# EAGLE design adns3050 v7 (EAGLE 6.6.0)
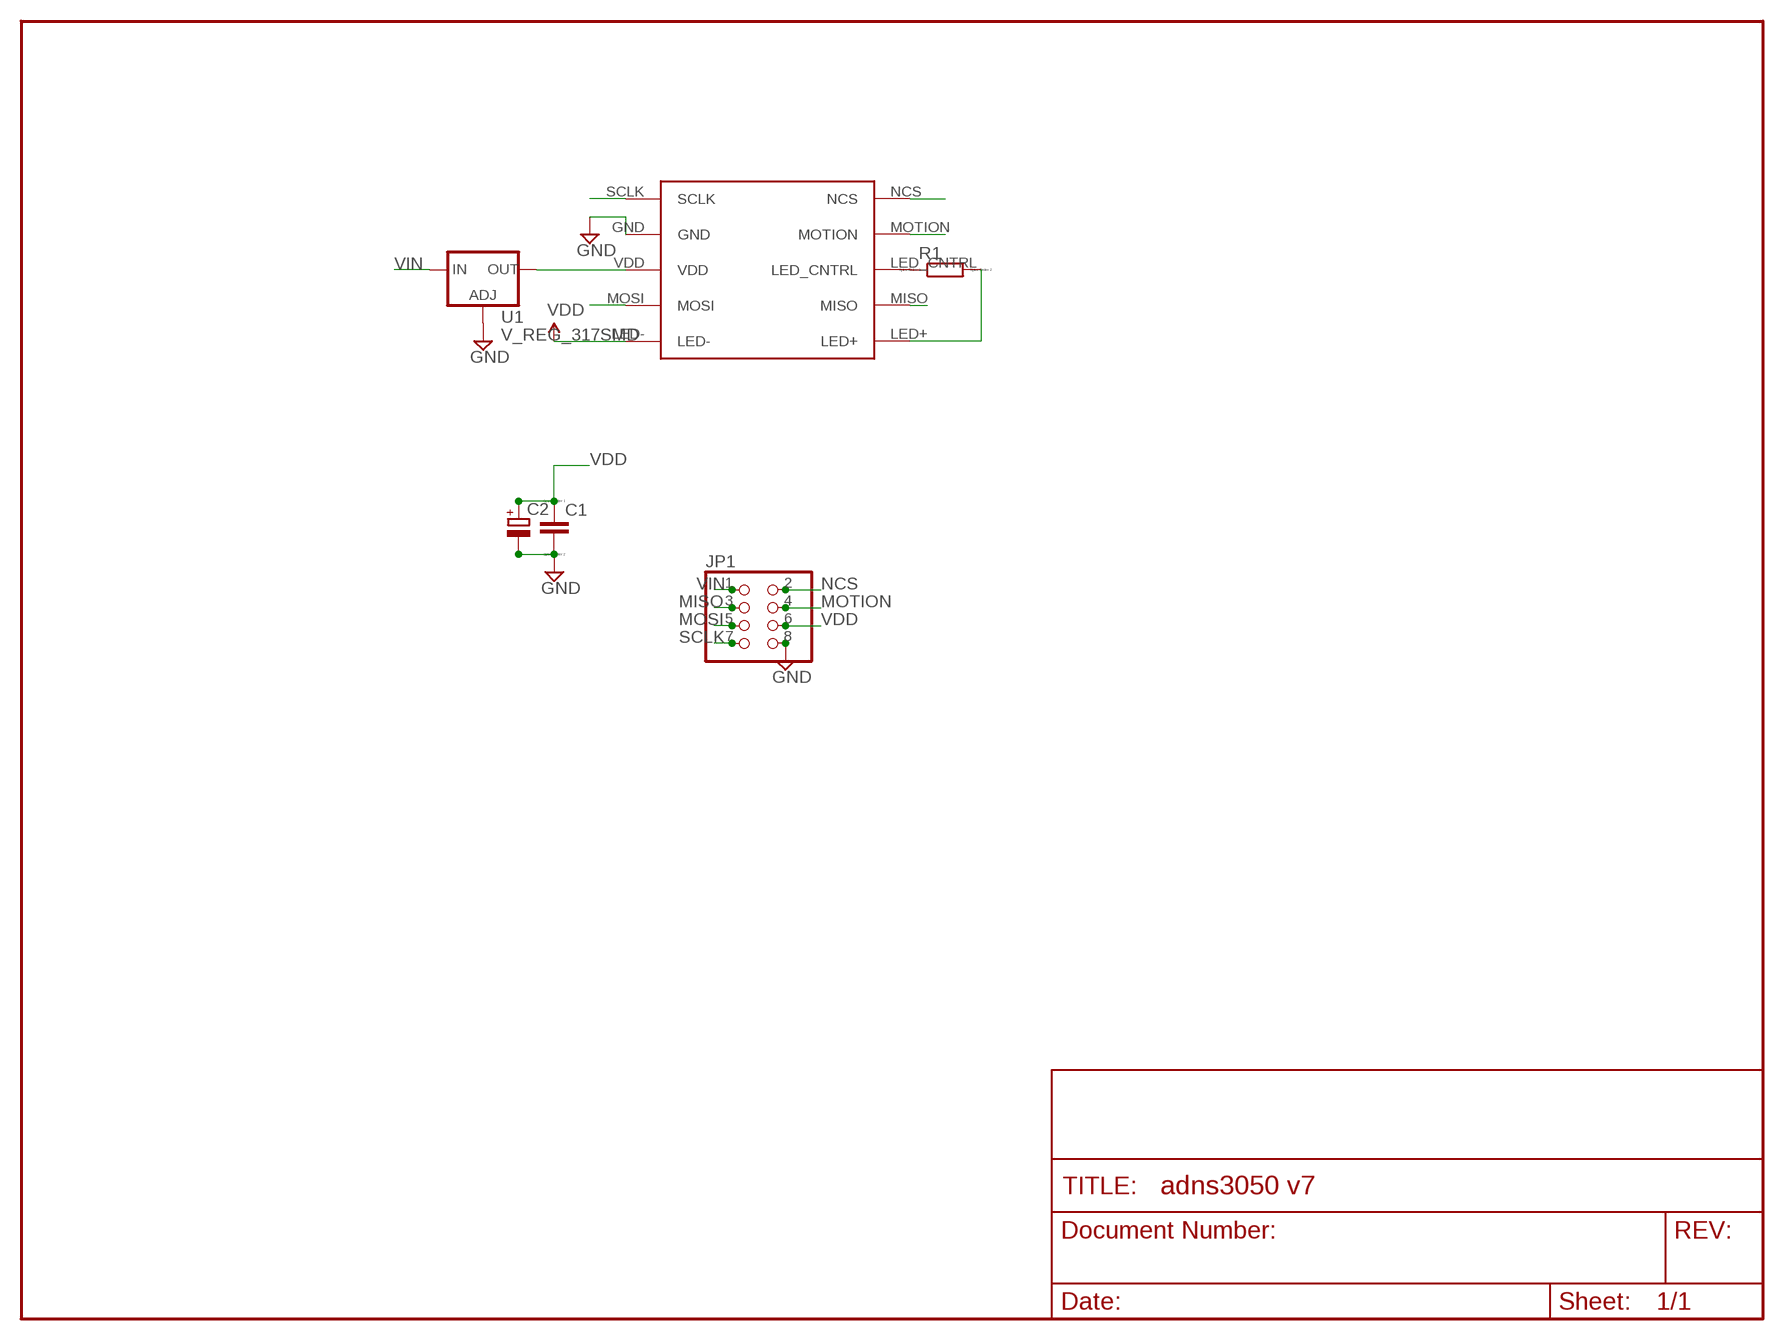
[diagram p0: schematic, sheet 1]

## Parts
C1  CC0603  [C0603]
C2  CPOL-EUR/2012-12R  [R/2012-12R]
JP1  PINHD-2X4  [2X04]
R1  RR0603  [R0603]
U1  V_REG_317SMD  [SOT223]
U$1  3050  [ADNS3]

## Nets
GND: C1.2 C2.- JP1.8 U1.1(ADJ) U$1.GND
MISO: JP1.3 U$1.MISO
MOSI: JP1.5 U$1.MOSI
MOTION: JP1.4 U$1.MOTION
N$1: R1.1 U$1.LED_CNTRL
N$3: R1.2 U$1.LED+
NCS: JP1.2 U$1.NCS
SCLK: JP1.7 U$1.SCLK
VDD: C1.1 C2.+ JP1.6 U1.2(OUT) U$1.LED- U$1.VDD
VIN: JP1.1 U1.3(IN)

## Library data of the parts
C1 = eagle-ltspice:C: CAPACITOR, European symbol; SPICEMODEL: NONE; SPICEPREFIX: C
C2 = rcl:CPOL-EU: POLARIZED CAPACITOR, European symbol
JP1 = pinhead:PINHD-2X4: PIN HEADER
R1 = eagle-ltspice:R: RESISTOR, European symbol; SPICEMODEL: NONE; SPICEPREFIX: R
U1 = SparkFun-PowerIC:V_REG_317: Voltage Regulator Standard LM317 adjustable voltage regulator. AOI (Adjust Output Input). Google 'LM317 Calculator' for easy to use app to get the two resistor values needed. 240/720 for 5V output. 240/390 for 3.3V output. Spark Fun Electronics SKU : COM-00527
U$1 = ADNS3050:3050

## Board
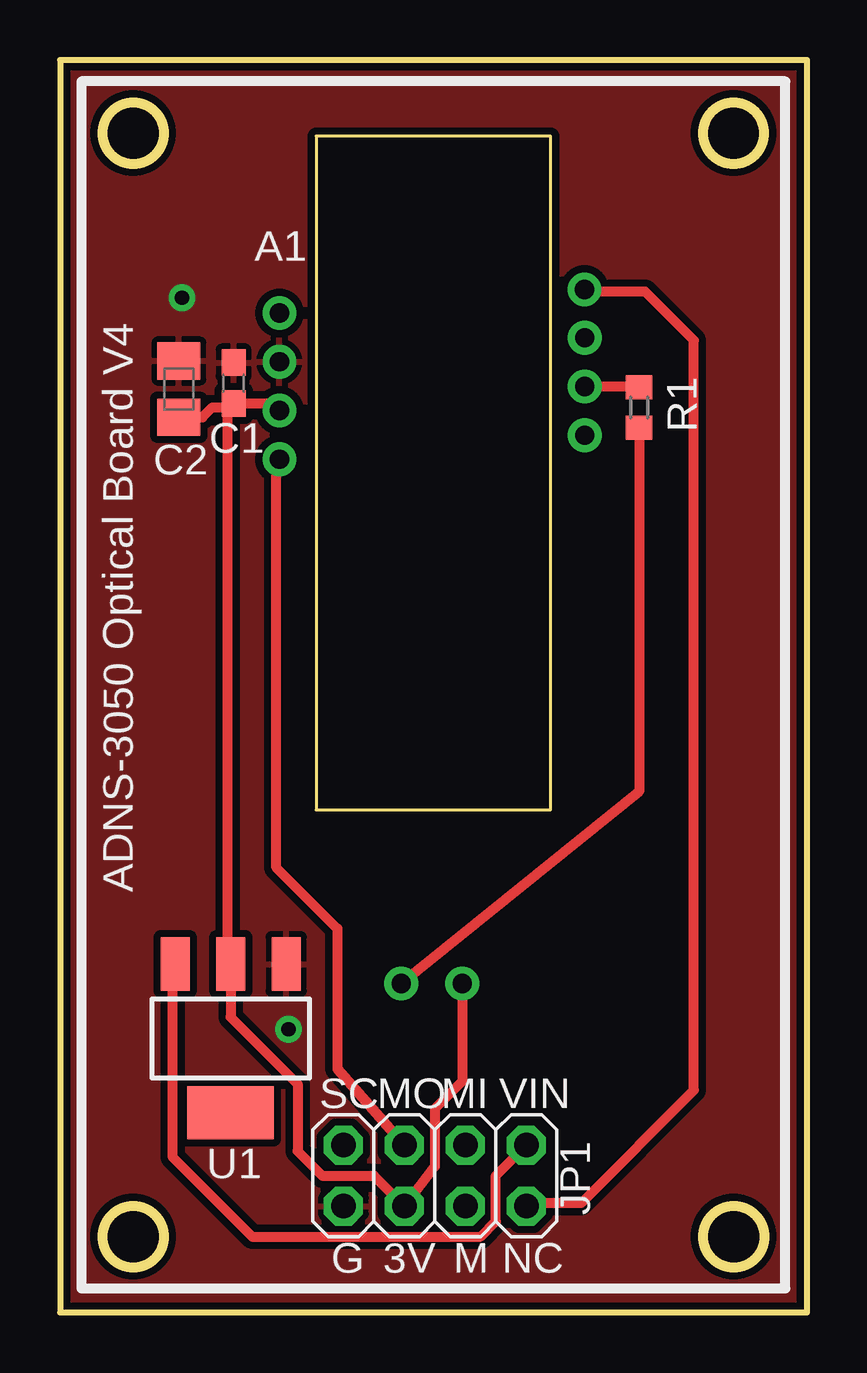
[diagram p1: board, top side]
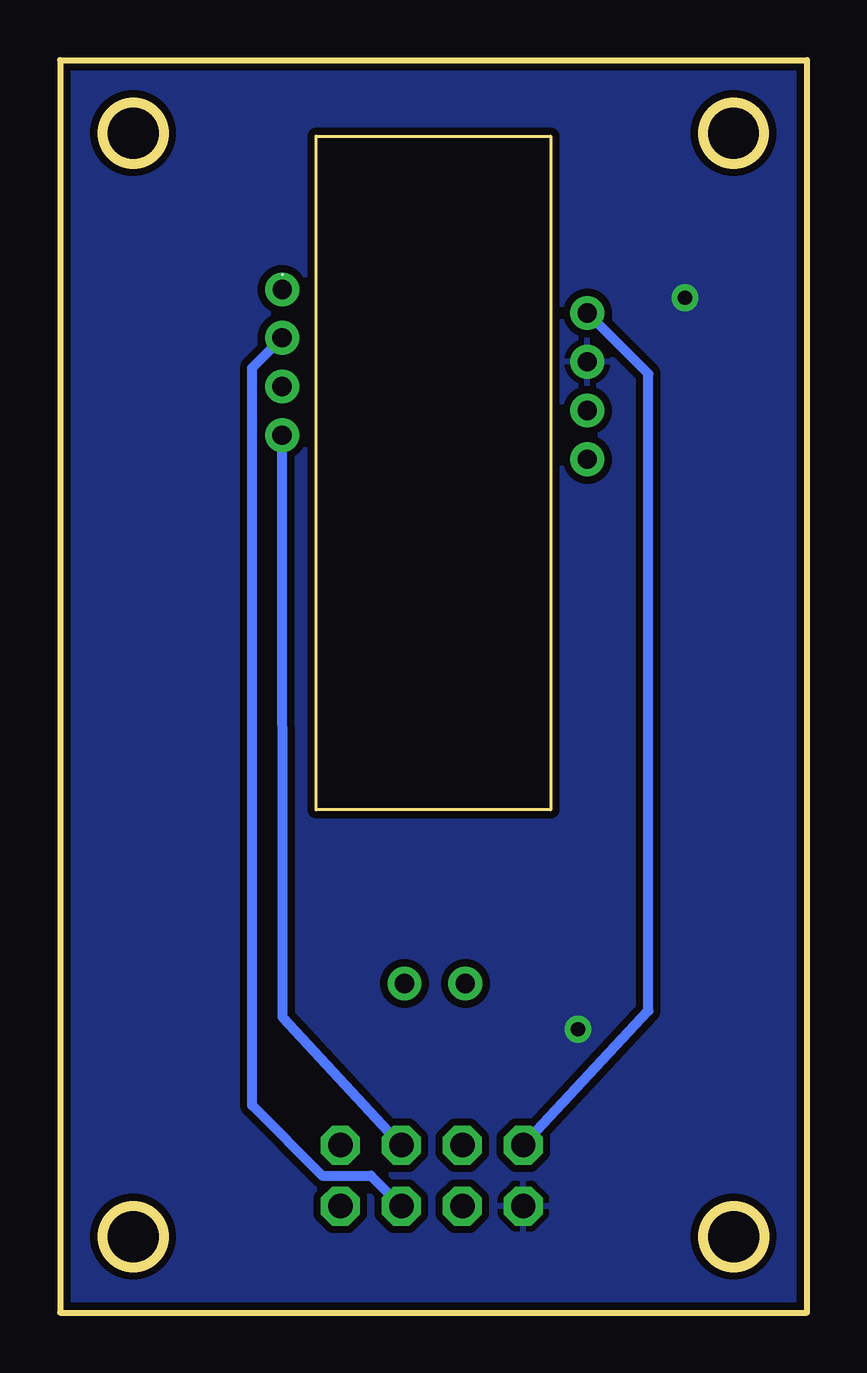
[diagram p2: board, bottom side, seen from below]

Size 31.11 x 52.2 mm. Coordinates in mm from the lower left corner, seen from the top.
Outline: 31.11,52.2 31.11,0 0,0 0,52.2 31.11,52.2
Outline: circle at 3.05,49.15 radius 1.27
Outline: circle at 28.07,49.15 radius 1.27
Outline: circle at 3.05,3.17 radius 1.28
Outline: circle at 28.07,3.17 radius 1.28
Copper layers (1*16): Top 0.035mm / dielectric 1.5mm / Bottom 0.035mm
Design rules "SparkFun *": minimum track width 8mil, minimum drill 20mil, track to track 8mil, track to pad 8mil, pad to pad 8mil, via to via 8mil, smd to smd 8mil, copper to edge 8mil, drill to drill 8mil, minimum pad ring 12mil, minimum via ring 10mil, stop-mask expansion 4mil, vias tented up to drill 25mil, thermal gap 10mil

### Footprints (pad centres in the part's own frame; a part is rotated, then mirrored left to right if it is on the bottom)
C0603 = smd 1.1 x 1: 1 -0.85,0; 2 0.85,0
R/2012-12R = smd 1.55 x 1.8: + 1.175,0; - -1.175,0
2X04 = drill 1.016 octagon: 1 -3.81,-1.27; 2 -3.81,1.27; 3 -1.27,-1.27; 4 -1.27,1.27; 5 1.27,-1.27; 6 1.27,1.27; 7 3.81,-1.27; 8 3.81,1.27
R0603 = smd 1 x 1.1: 1 -0.85,0; 2 0.85,0
SOT223 = smd 1.219 x 2.235: 1 -2.311,-3.099; 2 0,-3.099; 3 2.311,-3.099 | smd 3.6 x 2.2: 4 0,3.099
ADNS3 = drill 0.8: GND -6.35,3.683; LED+ -1.27,-22.225; LED- 1.27,-22.225; LED_CNTRL 6.367,2.653; MISO 6.367,0.621; MOSI -6.35,-0.381; MOTION 6.367,4.685; NCS 6.363,6.695; SCLK -6.35,5.715; VDD -6.35,1.651

### Placement (x,y rotation side)
C1  7.24,38.73 90 top
C2  4.95,38.48 270 top
JP1  15.62,5.71 180 top
R1  24.13,37.72 270 top
U1  7.11,11.43 180 top
U$1  15.49,35.94 0 top

### Tracks (layer width: path | path; a pad name or v marks a point on that pad's centre or on a via)
GND  (via drill 0.6, 0.6 pad 0.81)
  other vias: 9.53,11.81 5.08,42.29
  pour Bottom (isolate 0.305): 0,0 0,52.2 31.11,52.2 31.11,0
  pour Top (isolate 0.305): 0,0 0,52.2 31.11,52.2 31.11,0
MISO
  Bottom 0.406: U$1.MISO 21.84,12.32 JP1.3
MOSI
  Top 0.406: U$1.MOSI 9.02,35.43 9.02,18.54 11.56,16 11.56,10.16 JP1.5
MOTION
  Bottom 0.406: U$1.MOTION 23.11,39.37 23.11,8.64 20.19,5.71 18.16,5.71 JP1.4
N$1
  Top 0.406: U$1.LED_CNTRL 23.55,38.59 R1.1
N$3
  Top 0.406: R1.2 24.13,21.72 U$1.LED+
NCS
  Top 0.406: U$1.NCS 21.95,42.55 24.38,42.55 26.42,40.51 26.42,9.27 21.72,4.57 19.56,4.57 JP1.2
SCLK
  Bottom 0.406: U$1.SCLK 6.6,39.12 6.6,12.57 JP1.7
VDD
  Top 0.406: C1.1 8.85,37.89 U$1.VDD | 7.11,37.76 C1.1 | U1.2 7.11,12.32 9.91,9.53 9.91,6.73 10.92,5.71 13.08,5.71 JP1.6 15.62,6.1 15.62,8.51 16.76,9.65 U$1.LED- | U1.2 6.98,14.53 6.98,37.63 C1.1 | 7.02,14.62 U1.2 | C2.+ 5.94,37.31 6.35,37.72 7.07,37.72 C1.1
VIN
  Top 0.406: U1.3 4.7,14.43 4.7,6.48 8,3.17 17.53,3.17 18.16,3.81 18.16,5.71 JP1.1

### Text on the board
tPlace: A1 | ADNS-3050 Optical Board V4 | SC | MO | MI | VIN | U1 | G | 3V | M | NC